# Altium project Science.PrjPCB
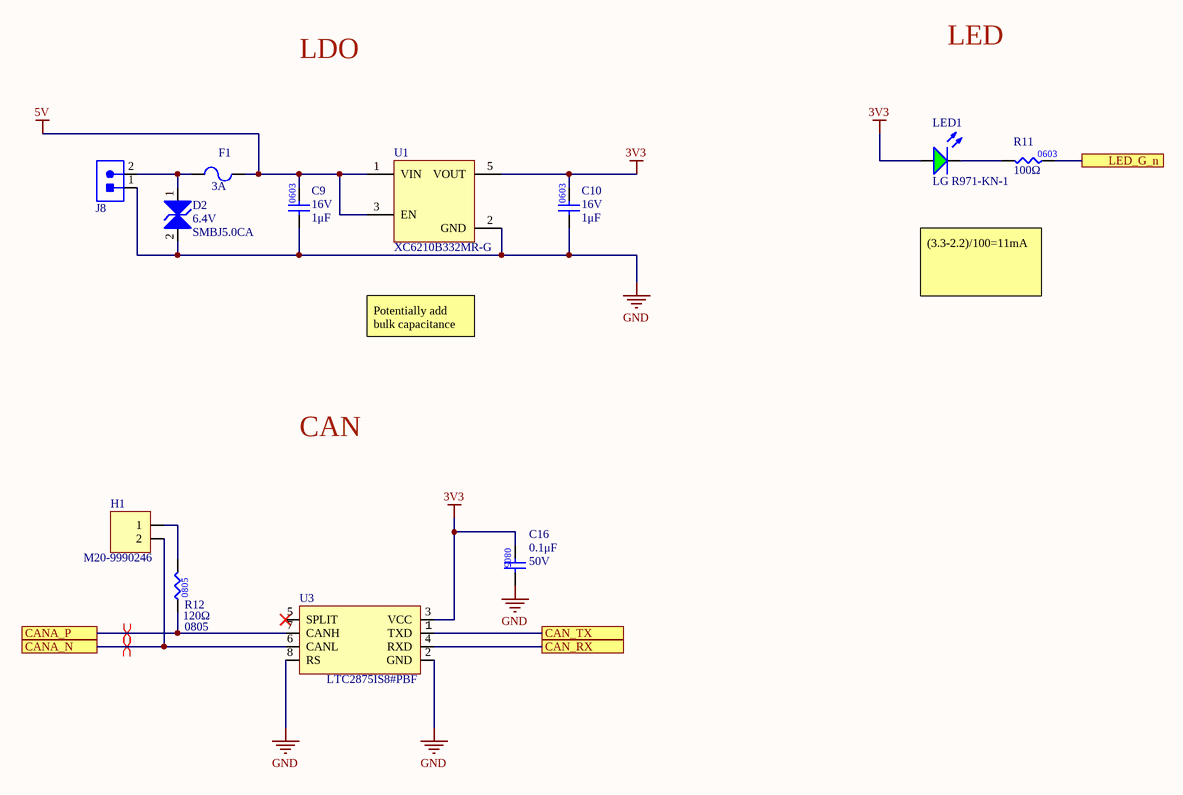
[diagram p0: SH1 - POWER, CAN, LED.SchDoc]
Address1: 200 University Avenue; Address2: Waterloo; Address3: Ontario; Address4: Canada N2L 3G6; BoardName: Your Board Name; DrawnBy: Your Name
5 sheets, 94 parts. Net scope: flat (ports and power ports of the same name join across sheets).
Board file: Science.PcbDoc
Sheets:
  SH1 - POWER, CAN, LED.SchDoc
  SH2 - CONNECTORS.SchDoc
  SH3 - MCU.SchDoc
  SH4 - Level Shifter.SchDoc
  SH5 - GPIO Expander.SchDoc

## Sheet SH1 - POWER, CAN, LED.SchDoc
size B

### Parts
C9  value 1μF  Voltage Rating: 16V  [CAP0603]  (hidden comment: CAP_1uF_16V_0603)
C10  value 1μF  Voltage Rating: 16V  [CAP0603]  (hidden comment: CAP_1uF_16V_0603)
C16  value 0.1μF  Voltage Rating: 50V  [CAP0805]  (hidden comment: CAP_0.1uF_50V_0805)
D2  Voltage - Breakdown (Min): 6.4V  Manufacturer Part Number 1: SMBJ5.0CA  [TVS_DIODE_BIDIR_SMB]  (hidden comment: TVS_DIODE_BIDIR_5V)
F1  FUSE_3A_0603  [FUSE_0603]  (value not drawn)
H1  Manufacturer Part Number 1: M20-9990246  [HDR1X2]  (hidden comment: JUMPER)
J8  CON_2POS_SCREW_TERM  [1935161]  (value not drawn)
LED1  Manufacturer Part Number 1: LG R971-KN-1  [LED_0805_GREEN]  (hidden comment: LED_GREEN)
R11  value 100Ω  [RES0603]  (hidden comment: RES_100Ω_0603_1%)
R12  value 120Ω  Package/Footprint: 0805  [RES0805]  (hidden comment: RES_120Ω_0805_1%)
U1  Manufacturer Part Number 1: XC6210B332MR-G  [SOT95P285X140-5N]  (hidden comment: LDO_3.3V_700mA)
U3  Manufacturer Part Number 1: LTC2875IS8#PBF  [LT-S8_N]  (hidden comment: IC_CAN_TRANSCEIVER)

### Ports
CAN_RX, CAN_TX, CANA_N, CANA_P, LED_G_n

### Nets
3V3: C10.2 C16.1 LED1.1(A) U1.5(VOUT) U3.3(VCC)
5V: C9.2 F1.2 U1.1(VIN) U1.3(EN)
GND: C9.1 C10.1 C16.2 D2.2 J8.1 U1.2(GND) U3.2(GND) U3.8(RS)
CAN_RX: U3.4(RXD) ; port CAN_RX
CAN_TX: U3.1(TXD) ; port CAN_TX
CANA_N: H1.2 U3.6(CANL) ; port CANA_N
CANA_P: R12.1 U3.7(CANH) ; port CANA_P
LED_G_n: R11.2 ; port LED_G_n
NetD2_1: D2.1 F1.1 J8.2
NetH1_1: H1.1 R12.2
NetLED1_2: LED1.2(K) R11.1

Not connected (* = marked no-connect by the designer): U3 5(SPLIT)*

### Layout directives
differential pair: CANA_N, CANA_P

### Notes on the sheet
- LDO
- LED
- (3.3-2.2)/100=11mA
- Potentially add bulk capacitance
- CAN
- (in symbol RES_100Ω_0603_1%) 0603

### Library data of the parts
C9 C10 = CAP_1uF_16V_0603: CAP CER 1UF 16V Y5V 0603; Manufacturer 1: Yageo; Manufacturer Part Number 1: CC0603ZRY5V7BB105; Supplier Part Number 1: 311-1372-1-ND; Supplier 1: Digi-Key; Mounting Type: SMD; Package: 0603; Dielectric: Y5V
C16 = CAP_0.1uF_50V_0805: CAP CER 0.1UF 50V X7R 0805; Manufacturer Part Number 1: GCM21BR71H104KA37K; Manufacturer 1: Murata Electronics; Package/Footprint: 0805; Supplier Part Number 1: 490-8049-1-ND; Supplier 1: Digi-Key; Dielectric: X7R; Mounting Type: SMD; LCSC Part #: C49678
D2 = TVS_DIODE_BIDIR_5V: TVS DIODE 5V 9.2V SMB; Manufacturer 1: Littelfuse; Package/Footprint: SMB; Supplier Part Number 1: SMBJ5.0CALFCT-ND; Supplier 1: Digi-Key; Mounting Type: SMD; Voltage - Reverse Standoff (Typ): 5V; Voltage - Clamping (Max) @ Ipp: 9.2V; Verified: No; LCSC Part #: *
F1 = FUSE_3A_0603: FUSE SMD 3A 32V 0603; Manufacturer Part Number 1: 0467003.NR; Manufacturer 1: Littelfuse; Supplier Part Number 1: F1399CT-ND; Supplier 1: Digi-Key; Voltage Rating (DC): 32V; Current Rating: 3A
H1 = JUMPER: HEADER 2X1; Manufacturer 1: Harwin Inc.; Package/Footprint: TH; Supplier 1: Digi-Key; Supplier Part Number 1: 952-2262-ND; Mounting Type: TH
J8 = CON_2POS_SCREW_TERM: TERM BLK 2POS SIDE ENTRY 5MM; Manufacturer 1: Phoenix Contact; Package/Footprint: SMD; Supplier 1: Digi-Key; Mounting Type: TH; Supplier Part Number 1: 277-1667-ND; Manufacturer Part Number 1: 1935161
LED1 = LED_GREEN: LED GREEN DIFFUSED 0805 SMD; Manufacturer 1: OSRAM; Forward Voltage Drop: 2.2V; Package/Footprint: 0805; Supplier Part Number 1: 475-1410-1-ND; Supplier 1: Digi-Key; Mounting Type: SMD
R11 = RES_100Ω_0603_1%: RES 100 OHM 1% 1/10W 0603; Manufacturer 1: Yageo; Manufacturer Part Number 1: RC0603FR-07100RL; Supplier Part Number 1: 311-100HRCT-ND; Supplier 1: Digi-Key
R12 = RES_120Ω_0805_1%: RES 120 OHM 1% 1/8W 0805; Manufacturer 1: Vishay; Manufacturer Part Number 1: CRCW0805120RFKEA; Supplier Part Number 1: 541-120CCT-ND; Supplier 1: Digi-Key; Mounting Type: SMD; LCSC Part #: C17437
U1 = LDO_3.3V_700mA: IC REG LINEAR 3.3V 700MA SOT25; Manufacturer 1: Diodes Incorporated; Input Voltage (Max): 6V; Voltage Dropout (Max): 0.075V; Package/Footprint: SOT-25; Output Voltage (Fixed): 3.3V; Output Current: 700mA; Operating Temperature: -40°C - 85°C; Mounting Type: SMD; Supplier 1: Digi-Key; Supplier Part Number 1: 893-1075-1-ND
U3 = IC_CAN_TRANSCEIVER: IC TXRX CAN 4MBPS 8SO; Manufacturer 1: Linear Technologies; Package/Footprint: 8-SOIC; Supplier Part Number 1: LTC2875IS8#PBF-ND; Supplier 1: Digi-Key; Mounting Type: SMD; LCSC Part #: C117076

## Sheet SH2 - CONNECTORS.SchDoc
size B
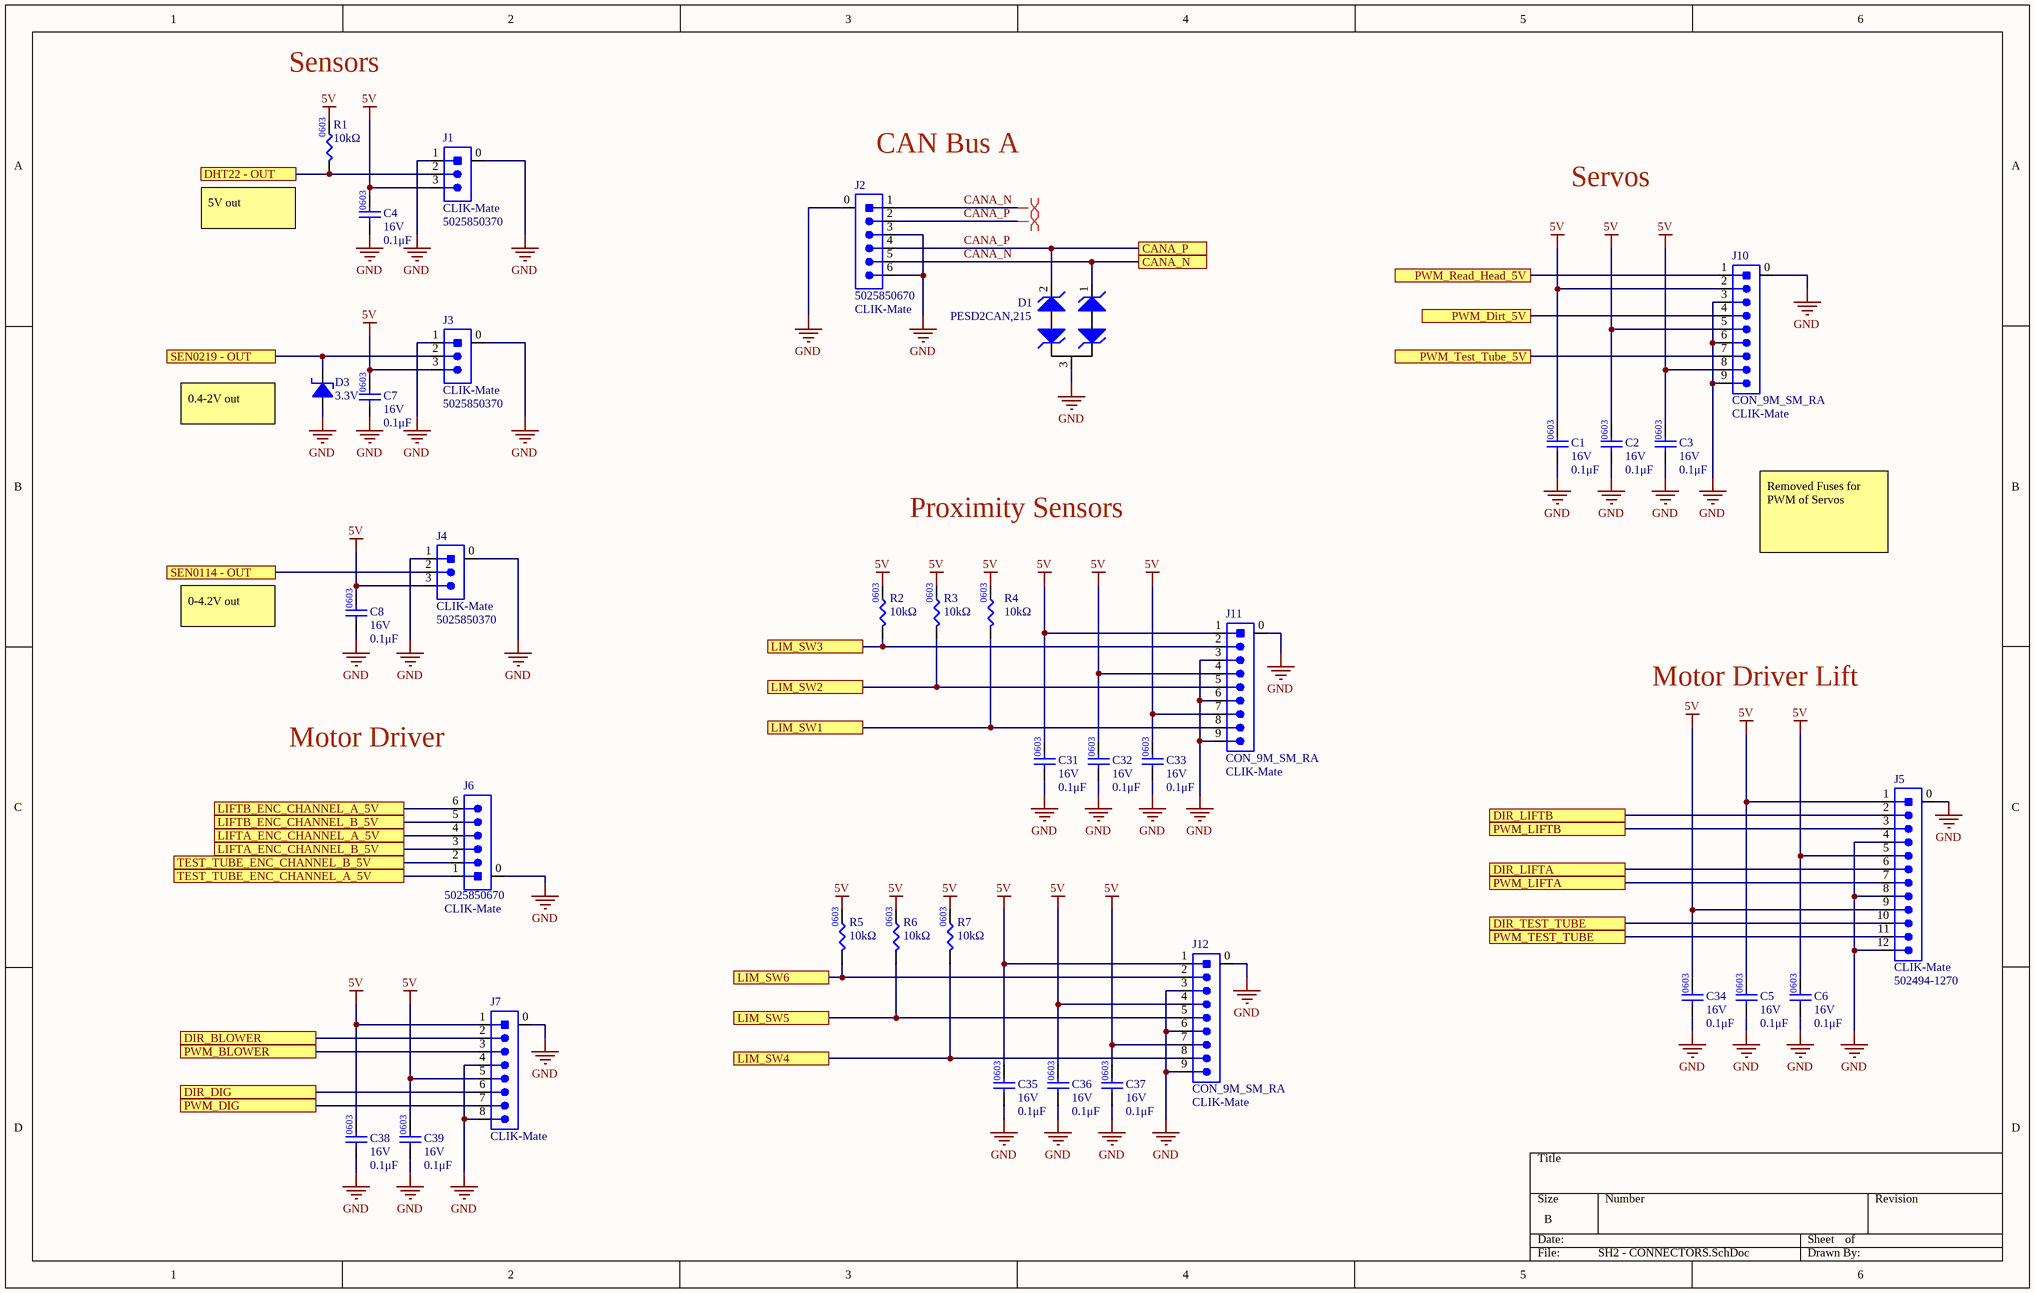
[diagram p1: SH2 - CONNECTORS.SchDoc]

### Parts
C1  value 0.1μF  Voltage Rating: 16V  [CAP0603]  (hidden comment: CAP_0.1uF_16V_0603)
C2  value 0.1μF  Voltage Rating: 16V  [CAP0603]  (hidden comment: CAP_0.1uF_16V_0603)
C3  value 0.1μF  Voltage Rating: 16V  [CAP0603]  (hidden comment: CAP_0.1uF_16V_0603)
C4  value 0.1μF  Voltage Rating: 16V  [CAP0603]  (hidden comment: CAP_0.1uF_16V_0603)
C5  value 0.1μF  Voltage Rating: 16V  [CAP0603]  (hidden comment: CAP_0.1uF_16V_0603)
C6  value 0.1μF  Voltage Rating: 16V  [CAP0603]  (hidden comment: CAP_0.1uF_16V_0603)
C7  value 0.1μF  Voltage Rating: 16V  [CAP0603]  (hidden comment: CAP_0.1uF_16V_0603)
C8  value 0.1μF  Voltage Rating: 16V  [CAP0603]  (hidden comment: CAP_0.1uF_16V_0603)
C31  value 0.1μF  Voltage Rating: 16V  [CAP0603]  (hidden comment: CAP_0.1uF_16V_0603)
C32  value 0.1μF  Voltage Rating: 16V  [CAP0603]  (hidden comment: CAP_0.1uF_16V_0603)
C33  value 0.1μF  Voltage Rating: 16V  [CAP0603]  (hidden comment: CAP_0.1uF_16V_0603)
C34  value 0.1μF  Voltage Rating: 16V  [CAP0603]  (hidden comment: CAP_0.1uF_16V_0603)
C35  value 0.1μF  Voltage Rating: 16V  [CAP0603]  (hidden comment: CAP_0.1uF_16V_0603)
C36  value 0.1μF  Voltage Rating: 16V  [CAP0603]  (hidden comment: CAP_0.1uF_16V_0603)
C37  value 0.1μF  Voltage Rating: 16V  [CAP0603]  (hidden comment: CAP_0.1uF_16V_0603)
C38  value 0.1μF  Voltage Rating: 16V  [CAP0603]  (hidden comment: CAP_0.1uF_16V_0603)
C39  value 0.1μF  Voltage Rating: 16V  [CAP0603]  (hidden comment: CAP_0.1uF_16V_0603)
D1  Manufacturer Part Number 1: PESD2CAN,215  [TVS_DIODE_CAN]  (hidden comment: TVS_DIODE_CAN)
D3  Working Voltage: 3.3V  [DIO_ZENER_3V3]  (hidden comment: DIO_ZENER_3V3)
J1  Family: CLIK-Mate  Manufacturer Part Number 1: 5025850370  [MOLEX-5025850370]  (hidden comment: CON_3M_SM_RA)
J2  Manufacturer Part Number 1: 5025850670  Family: CLIK-Mate  [MOLEX-5025850670]  (hidden comment: CON_6M_SM_RA_1.5mm)
J3  Family: CLIK-Mate  Manufacturer Part Number 1: 5025850370  [MOLEX-5025850370]  (hidden comment: CON_3M_SM_RA)
J4  Family: CLIK-Mate  Manufacturer Part Number 1: 5025850370  [MOLEX-5025850370]  (hidden comment: CON_3M_SM_RA)
J5  Family: CLIK-Mate  Supplier Part Number 1: 502494-1270  [MOLEX-5024941270]  (hidden comment: CON_12M_SM_RA_2mm)
J6  Manufacturer Part Number 1: 5025850670  Family: CLIK-Mate  [MOLEX-5025850670]  (hidden comment: CON_6M_SM_RA_1.5mm)
J7  Family: CLIK-Mate  [5024430870]  (hidden comment: CON_8M_SM_RA)
J10  CON_9M_SM_RA  Family: CLIK-Mate  [Molex-5025850970]
J11  CON_9M_SM_RA  Family: CLIK-Mate  [Molex-5025850970]
J12  CON_9M_SM_RA  Family: CLIK-Mate  [Molex-5025850970]
R1  value 10kΩ  [RES0603]  (hidden comment: RES_10kΩ_0603_5%)
R2  value 10kΩ  [RES0603]  (hidden comment: RES_10kΩ_0603_5%)
R3  value 10kΩ  [RES0603]  (hidden comment: RES_10kΩ_0603_5%)
R4  value 10kΩ  [RES0603]  (hidden comment: RES_10kΩ_0603_5%)
R5  value 10kΩ  [RES0603]  (hidden comment: RES_10kΩ_0603_5%)
R6  value 10kΩ  [RES0603]  (hidden comment: RES_10kΩ_0603_5%)
R7  value 10kΩ  [RES0603]  (hidden comment: RES_10kΩ_0603_5%)

### Ports
CANA_N, CANA_P, DHT22 - OUT, DIR_BLOWER, DIR_DIG, DIR_LIFTA, DIR_LIFTB, DIR_TEST_TUBE, LIFTA_ENC_CHANNEL_A_5V, LIFTA_ENC_CHANNEL_B_5V, LIFTB_ENC_CHANNEL_A_5V, LIFTB_ENC_CHANNEL_B_5V, LIM_SW1, LIM_SW2, LIM_SW3, LIM_SW4, LIM_SW5, LIM_SW6, PWM_BLOWER, PWM_DIG, PWM_Dirt_5V, PWM_LIFTA, PWM_LIFTB, PWM_Read_Head_5V, PWM_TEST_TUBE, PWM_Test_Tube_5V, SEN0114 - OUT, SEN0219 - OUT, TEST_TUBE_ENC_CHANNEL_A_5V, TEST_TUBE_ENC_CHANNEL_B_5V

### Nets
5V: C1.2 C2.2 C3.2 C4.2 C5.2 C6.2 C7.2 C8.2 C31.2 C32.2 C33.2 C34.2 C35.2 C36.2 C37.2 C38.2 C39.2 J1.3 J3.3 J4.3 J5.1 J5.5 J5.9 J7.1 J7.5 J10.2 J10.5 J10.8 J11.1 J11.4 J11.7 J12.1 J12.4 J12.7 R1.2 R2.2 R3.2 R4.2 R5.2 R6.2 R7.2
GND: C1.1 C2.1 C3.1 C4.1 C5.1 C6.1 C7.1 C8.1 C31.1 C32.1 C33.1 C34.1 C35.1 C36.1 C37.1 C38.1 C39.1 D1.3 D3.1(Anode) J1.0 J1.1 J2.0 J2.3 J2.6 J3.0 J3.1 J4.0 J4.1 J5.0 J5.4 J5.8 J5.12 J6.0 J7.0 J7.4 J7.8 J10.0 J10.3 J10.6 J10.9 J11.0 J11.3 J11.6 J11.9 J12.0 J12.3 J12.6 J12.9
CANA_N: D1.1 J2.1 J2.5 ; port CANA_N
CANA_P: D1.2 J2.2 J2.4 ; port CANA_P
DHT22 - OUT: J1.2 R1.1 ; port DHT22 - OUT
DIR_BLOWER: J7.2 ; port DIR_BLOWER
DIR_DIG: J7.6 ; port DIR_DIG
DIR_LIFTA: J5.6 ; port DIR_LIFTA
DIR_LIFTB: J5.2 ; port DIR_LIFTB
DIR_TEST_TUBE: J5.10 ; port DIR_TEST_TUBE
LIFTA_ENC_CHANNEL_A_5V: J6.4 ; port LIFTA_ENC_CHANNEL_A_5V
LIFTA_ENC_CHANNEL_B_5V: J6.3 ; port LIFTA_ENC_CHANNEL_B_5V
LIFTB_ENC_CHANNEL_A_5V: J6.6 ; port LIFTB_ENC_CHANNEL_A_5V
LIFTB_ENC_CHANNEL_B_5V: J6.5 ; port LIFTB_ENC_CHANNEL_B_5V
LIM_SW1: J11.8 R4.1 ; port LIM_SW1
LIM_SW2: J11.5 R3.1 ; port LIM_SW2
LIM_SW3: J11.2 R2.1 ; port LIM_SW3
LIM_SW4: J12.8 R7.1 ; port LIM_SW4
LIM_SW5: J12.5 R6.1 ; port LIM_SW5
LIM_SW6: J12.2 R5.1 ; port LIM_SW6
PWM_BLOWER: J7.3 ; port PWM_BLOWER
PWM_DIG: J7.7 ; port PWM_DIG
PWM_Dirt_5V: J10.4 ; port PWM_Dirt_5V
PWM_LIFTA: J5.7 ; port PWM_LIFTA
PWM_LIFTB: J5.3 ; port PWM_LIFTB
PWM_Read_Head_5V: J10.1 ; port PWM_Read_Head_5V
PWM_TEST_TUBE: J5.11 ; port PWM_TEST_TUBE
PWM_Test_Tube_5V: J10.7 ; port PWM_Test_Tube_5V
SEN0114 - OUT: J4.2 ; port SEN0114 - OUT
SEN0219 - OUT: D3.2(Cathode) J3.2 ; port SEN0219 - OUT
TEST_TUBE_ENC_CHANNEL_A_5V: J6.1 ; port TEST_TUBE_ENC_CHANNEL_A_5V
TEST_TUBE_ENC_CHANNEL_B_5V: J6.2 ; port TEST_TUBE_ENC_CHANNEL_B_5V

### Layout directives
differential pair: CANA_N, CANA_P

### Notes on the sheet
- Sensors
- (near J2) CAN Bus A
- (near R1) 5V out
- Servos
- (near D3) 0.4-2V out
- Proximity Sensors
- Removed Fuses for PWM of Servos
- 0-4.2V out
- Motor Driver Lift
- Motor Driver

### Library data of the parts
C1-C8 C31-C39 = CAP_0.1uF_16V_0603: CAP CER 0.1UF 16V X7R 0603; Manufacturer Part Number 1: CC0603KRX7R7BB104; Manufacturer 1: Yageo; Package: 0603; Supplier Part Number 1: 311-1088-1-ND; Supplier 1: Digi-Key; Dielectric: X7R
D1 = TVS_DIODE_CAN: TVS DIODE 24V 41V SOT323-3; Manufacturer 1: Nexperia USA Inc.; Voltage - Breakdown (Min): 26.2V; Supplier Part Number 1: 1727-3891-1-ND; Supplier 1: Digi-Key; Package/Footprint: SOT323-3; Mounting Type: SMD; Verified: Yes; Voltage - Reverse Standoff (Typ): 24V; Voltage - Clamping (Max) @ Ipp: 41V
D3 = DIO_ZENER_3V3: DIODE ZENER 3.3V 200mW SOD323F; Manufacturer 1: ON Semiconductor / Fairchild; Manufacturer Part Number 1: MM3Z3V3B; Forward Voltage: 1V; Supplier Part Number 1: MM3Z3V3BCT-ND; Supplier 1: Digi-Key; Package/Case: SOD323F
J1 J3 J4 = CON_3M_SM_RA: CONN RCPT 3POS 0.059 TIN SMD R/A; Manufacturer 1: Molex; Current Rating: 2A; Voltage Rating: 100V; Pitch: 1.5mm; Supplier 1: Digi-Key; Mounting Type: SMD; Package/Footprint: SMD; Orientation: Right Angle; Supplier Part Number 1: WM12831CT-ND
J2 J6 = CON_6M_SM_RA_1.5mm: CONN HEADER SMD RIGHT ANGLE 1.5 MM PITCH; Manufacturer 1: Molex; Supplier 1: Digi-Key; Supplier Part Number 1: WM12832CT-ND; Package/Footprint: SMD; Mounting Type: SMD
J5 = CON_12M_SM_RA_2mm: 2.00mm Pitch CLIK-Mate Wire-to-Board PCB Receptacle, Single Row, Right-Angle, 12 Circuits; Manufacturer: Molex; Number of Contacts: 12; Contact Resistance: 20mR; Current Rating: 3A; Mating Cycles: 30; Voltage Rating (AC): 250V; Insulation Resistance: 1GR; Pitch: 2mm; Glow Wire Compliant: Non-compliant; Supplier 1: Mouser; Manufacturer Part Number: 502494-1270; RoHS: Yes; Category: Headers and Wire Housings; Stock 1: 1900; Pricing 1: 950=0.62780, 1900=0.61060, 3800=0.56580, 5700=0.53600, 7600=0.52000 (USD); Mount: Surface Mount; Color: Natural,White; Contact Plating: Tin; Contact Material: Copper Alloy; Housing Material: PBT; Material: Polybutylene; Housing Color: Natural; Min Operating Temperature: -25°C; Max Operating Temperature: 85°C; Number of Rows: 1; Termination: Solder; Fastening Type: Latch; Packaging: Tape and Reel; Contact Gender: Female; Package Quantity: 950; Connector Type: Receptacle; Number of Positions: 12; Max Voltage Rating (AC): 250V; Max Voltage Rating (DC): 250V; Gender: Receptacle; Orientation: Right Angle; Number of Circuits: 12; Series: 502494; Contact Type: Center Strip Contact; Length: 28mm; Lead Pitch: 2mm; Depth: 6.85mm; Radiation Hardening: No; REACH SVHC: Unknown; Flammability Rating: UL94 V-0
J7 = CON_8M_SM: CONN HEADER SMD VERTICAL 2 MM PITCH; Current Rating: 3A; Voltage Rating: 250V; Pitch: 1.5mm; Supplier 1: Digi-Key; Mounting Type: SMD; Package/Footprint: SMD; Orientation: Right Angle; Supplier Part Number 1: WM14471CT-ND
J10-J12 = CON_9M_SM_RA: CONN RCPT 9POS CLIK-MATE 0.059 TIN SMD R/A; Current Rating: 2A; Pitch: 1.5mm; Supplier 1: Digi-Key; Orientation: Right Angle; Supplier Part Number 1: WM20816CT-ND
R1-R7 = RES_10kΩ_0603_5%: RES 10K OHM 5% 1/10W 0603; Manufacturer 1: Yageo; Manufacturer Part Number 1: RC0603JR-0710KL; Supplier Part Number 1: 311-10KGRCT-ND; Supplier 1: Digi-Key; Mounting Type: SMD; Package: 0603

## Sheet SH3 - MCU.SchDoc
size B
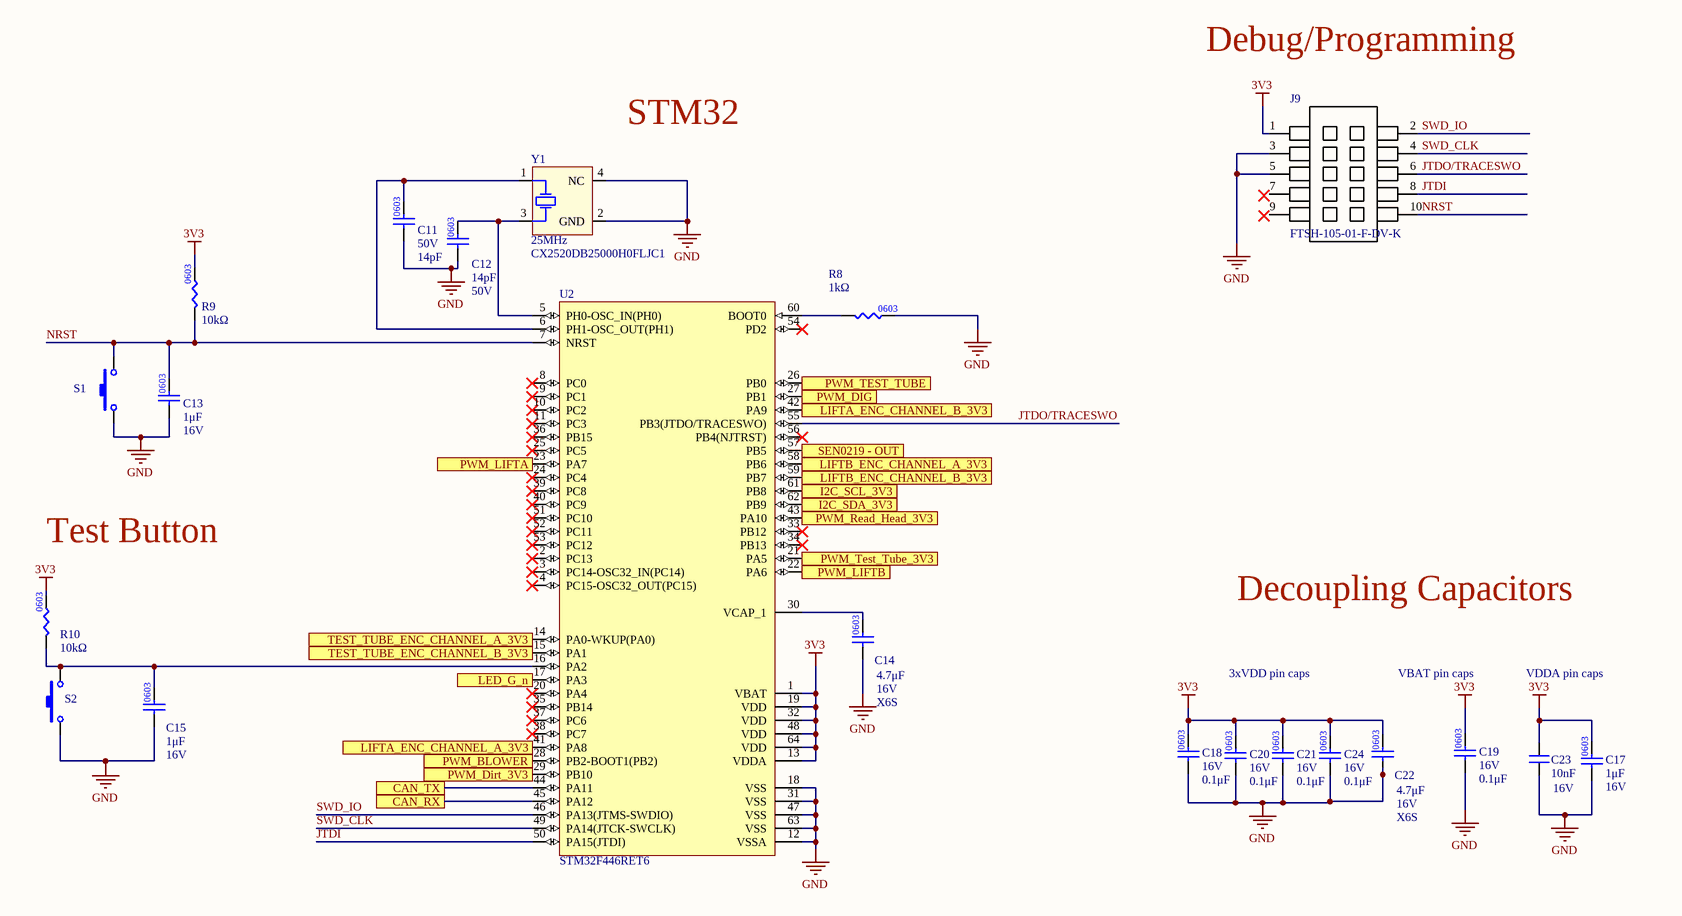
[diagram p2: SH3 - MCU.SchDoc]

### Parts
C11  value 14pF  Voltage Rating: 50V  [CAP0603]  (hidden comment: CAP_14pF_50V_0603)
C12  value 14pF  Voltage Rating: 50V  [CAP0603]  (hidden comment: CAP_14pF_50V_0603)
C13  value 1μF  Voltage Rating: 16V  [CAP0603]  (hidden comment: CAP_1uF_16V_0603)
C14  value 4.7μF  Dielectric: X6S  Voltage Rating: 16V  [CAP0603]  (hidden comment: CAP_4.7uF_16V_0603)
C15  value 1μF  Voltage Rating: 16V  [CAP0603]  (hidden comment: CAP_1uF_16V_0603)
C17  value 1μF  Voltage Rating: 16V  [CAP0603]  (hidden comment: CAP_1uF_16V_0603)
C18  value 0.1μF  Voltage Rating: 16V  [CAP0603]  (hidden comment: CAP_0.1uF_16V_0603)
C19  value 0.1μF  Voltage Rating: 16V  [CAP0603]  (hidden comment: CAP_0.1uF_16V_0603)
C20  value 0.1μF  Voltage Rating: 16V  [CAP0603]  (hidden comment: CAP_0.1uF_16V_0603)
C21  value 0.1μF  Voltage Rating: 16V  [CAP0603]  (hidden comment: CAP_0.1uF_16V_0603)
C22  value 4.7μF  Dielectric: X6S  Voltage Rating: 16V  [CAP0603]  (hidden comment: CAP_4.7uF_16V_0603)
C23  value 10nF  Voltage Rating: 16V  [CAP0603]  (hidden comment: CAP_10nF_0603)
C24  value 0.1μF  Voltage Rating: 16V  [CAP0603]  (hidden comment: CAP_0.1uF_16V_0603)
J9  Manufacturer Part Number 1: FTSH-105-01-F-DV-K  [FTSH-105-01-F-DV-K-P-TR]  (hidden comment: CON_PROGRAMMING)
R8  value 1kΩ  [RES0603]  (hidden comment: RES_1kΩ_0603_5%)
R9  value 10kΩ  [RES0603]  (hidden comment: RES_10kΩ_0603_5%)
R10  value 10kΩ  [RES0603]  (hidden comment: RES_10kΩ_0603_5%)
S1  SW_TACTILE  [B3U-1000P]  (value not drawn)
S2  SW_TACTILE  [B3U-1000P]  (value not drawn)
U2  STM32F446RET6  [STM-LQFP64_L]
Y1  Frequency: 25MHz  Manufacturer Part Number 1: CX2520DB25000H0FLJC1  [SOIC254P1016X440-4N]  (hidden comment: CRYSTAL_25MHZ)

### Ports
CAN_RX, CAN_TX, I2C_SCL_3V3, I2C_SDA_3V3, LED_G_n, LIFTA_ENC_CHANNEL_A_3V3, LIFTA_ENC_CHANNEL_B_3V3, LIFTB_ENC_CHANNEL_A_3V3, LIFTB_ENC_CHANNEL_B_3V3, PWM_BLOWER, PWM_DIG, PWM_Dirt_3V3, PWM_LIFTA, PWM_LIFTB, PWM_Read_Head_3V3, PWM_TEST_TUBE, PWM_Test_Tube_3V3, SEN0219 - OUT, TEST_TUBE_ENC_CHANNEL_A_3V3, TEST_TUBE_ENC_CHANNEL_B_3V3

### Nets
3V3: C17.2 C18.2 C19.2 C20.2 C21.2 C22.2 C23.2 C24.2 J9.1 R9.2 R10.2 U2.1(VBAT) U2.13(VDDA) U2.19(VDD) U2.32(VDD) U2.48(VDD) U2.64(VDD)
GND: C11.1 C12.1 C13.1 C14.1 C15.1 C17.1 C18.1 C19.1 C20.1 C21.1 C22.1 C23.1 C24.1 J9.3 J9.5 R8.2 S1.2 S2.1 U2.12(VSSA) U2.18(VSS) U2.31(VSS) U2.47(VSS) U2.63(VSS) Y1.2(GND) Y1.4(NC)
CAN_RX: U2.45(PA12) ; port CAN_RX
CAN_TX: U2.44(PA11) ; port CAN_TX
I2C_SCL_3V3: U2.61(PB8) ; port I2C_SCL_3V3
I2C_SDA_3V3: U2.62(PB9) ; port I2C_SDA_3V3
JTDI: J9.8 U2.50(PA15(JTDI))
JTDO/TRACESWO: J9.6 U2.55(PB3(JTDO/TRACESWO))
LED_G_n: U2.17(PA3) ; port LED_G_n
LIFTA_ENC_CHANNEL_A_3V3: U2.41(PA8) ; port LIFTA_ENC_CHANNEL_A_3V3
LIFTA_ENC_CHANNEL_B_3V3: U2.42(PA9) ; port LIFTA_ENC_CHANNEL_B_3V3
LIFTB_ENC_CHANNEL_A_3V3: U2.58(PB6) ; port LIFTB_ENC_CHANNEL_A_3V3
LIFTB_ENC_CHANNEL_B_3V3: U2.59(PB7) ; port LIFTB_ENC_CHANNEL_B_3V3
NRST: C13.2 J9.10 R9.1 S1.1 U2.7(NRST)
PWM_BLOWER: U2.28(PB2-BOOT1(PB2)) ; port PWM_BLOWER
PWM_DIG: U2.27(PB1) ; port PWM_DIG
PWM_Dirt_3V3: U2.29(PB10) ; port PWM_Dirt_3V3
PWM_LIFTA: U2.23(PA7) ; port PWM_LIFTA
PWM_LIFTB: U2.22(PA6) ; port PWM_LIFTB
PWM_Read_Head_3V3: U2.43(PA10) ; port PWM_Read_Head_3V3
PWM_TEST_TUBE: U2.26(PB0) ; port PWM_TEST_TUBE
PWM_Test_Tube_3V3: U2.21(PA5) ; port PWM_Test_Tube_3V3
SEN0219 - OUT: U2.57(PB5) ; port SEN0219 - OUT
SWD_CLK: J9.4 U2.49(PA14(JTCK-SWCLK))
SWD_IO: J9.2 U2.46(PA13(JTMS-SWDIO))
TEST_TUBE_ENC_CHANNEL_A_3V3: U2.14(PA0-WKUP(PA0)) ; port TEST_TUBE_ENC_CHANNEL_A_3V3
TEST_TUBE_ENC_CHANNEL_B_3V3: U2.15(PA1) ; port TEST_TUBE_ENC_CHANNEL_B_3V3
NetC11_2: C11.2 U2.6(PH1-OSC_OUT(PH1)) Y1.1(HOT)
NetC12_2: C12.2 U2.5(PH0-OSC_IN(PH0)) Y1.3(HOT)
NetC14_2: C14.2 U2.30(VCAP_1)
NetC15_2: C15.2 R10.1 S2.2 U2.16(PA2)
NetR8_1: R8.1 U2.60(BOOT0)

Not connected (* = marked no-connect by the designer): J9 7 9; U2 2(PC13)* 3(PC14-OSC32_IN(PC14))* 4(PC15-OSC32_OUT(PC15))* 8(PC0)* 9(PC1)* 10(PC2)* 11(PC3)* 20(PA4)* 24(PC4)* 25(PC5)* 33(PB12)* 34(PB13)* 35(PB14)* 36(PB15)* 37(PC6)* 38(PC7)* 39(PC8)* 40(PC9)* 51(PC10)* 52(PC11)* 53(PC12)* 54(PD2)* 56(PB4(NJTRST))*

### Notes on the sheet
- Debug/Programming
- STM32
- Test Button
- Decoupling Capacitors
- 3xVDD pin caps
- VBAT pin caps
- VDDA pin caps

### Library data of the parts
C11 C12 = CAP_14pF_50V_0603: CAP CER 14PF 50V C0G/NP0 0603; Manufacturer 1: Samsung; Manufacturer Part Number 1: CL10C140JB8NNNC; Dielectric: C0G; Supplier 1: Digi-Key; Supplier Part Number 1: 1276-2187-1-ND; Mounting Type: SMD; Package: 0603
C13 C15 C17 = CAP_1uF_16V_0603: as C9 on sheet SH1 - POWER, CAN, LED; Dielectric: Y5V; Supplier 1: Digi-Key; Supplier Part Number 1: 311-1372-1-ND; Package: 0603; Mounting Type: SMD
C14 C22 = CAP_4.7uF_16V_0603: CAP CER 4.7UF 16V X6S 0603; Manufacturer Part Number 1: GRM188C81C475KE11D; Manufacturer 1: Murata Electronics; Package: 0603; Supplier Part Number 1: 490-13362-1-ND; Supplier 1: Digi-Key; Mounting Type: SMD
C18-C21 C24 = CAP_0.1uF_16V_0603: as C1 on sheet SH2 - CONNECTORS; Package: 0603; Supplier Part Number 1: 311-1088-1-ND; Supplier 1: Digi-Key; Dielectric: X7R
C23 = CAP_10nF_0603: CAP CER 10000PF 16V X7R 0603; Manufacturer Part Number 1: CC0603KRX7R7BB103; Manufacturer 1: Yageo; Package/Footprint: 0603; Supplier Part Number 1: 311-3369-1-ND; Supplier 1: Digi-Key; Dielectric: X7R; Mounting Type: SMD
J9 = CON_PROGRAMMING: CONN HEADER SMD 10POS 1.27MM; Manufacturer 1: Samtec; Supplier 1: Digi-Key; Pitch: 1.27mm; Supplier Part Number 1: SAM8796-ND; Mounting Type: SMD
R8 = RES_1kΩ_0603_5%: RES 1K OHM 5% 1/10W 0603; Manufacturer 1: Yageo; Manufacturer Part Number 1: RC0603JR-071KL; Supplier Part Number 1: 311-1.0KGRCT-ND; Supplier 1: Digi-Key; Mounting Type: SMD; Package: 0603
R9 R10 = RES_10kΩ_0603_5%: as R1 on sheet SH2 - CONNECTORS; Supplier 1: Digi-Key; Supplier Part Number 1: 311-10KGRCT-ND; Package: 0603; Mounting Type: SMD
S1 S2 = SW_TACTILE: SWITCH TACTILE SPST-NO 0.05A 12V; Manufacturer 1: Omron Electronics Inc-EMC Div; Package/Footprint: SMD; Manufacturer Part Number 1: B3U-1000P; Supplier 1: Digi-Key; Supplier Part Number 1: SW1020CT-ND; Mounting Type: SMD
U2 = MCU_STM32F446RET6: ARM Cortex-M4 32-bit MCU+FPU, 512 KB Flash, 128 KB Internal RAM, 50 I/Os, 64-Pin LQFP, -40 to 85 degC, Tray; I/Os (High Current): 50; Supply Voltage(Vcc) min (V): 1.7; Operating Frequency(F) (Processor speed) (MHz): 180; D/A Converter: 2; Internal RAM Size (kB): 128; FLASH Size (Prog) (kB): 512; Core: ARM Cortex-M4; ComponentLink1Description: Manufacturer URL; Package Reference: 64-Pin Low-profile Quad Flat Package, Body 10 x 10 mm, Pitch 0.5 mm; ComponentLink2URL: http://www.st.com/st-web-ui/static/active/en/resource/technical/document/datasheet/DM00141306.pdf; Packing: Tray; DatasheetVersion: Rev. 6; ComponentLink1URL: http://www.st.com/; ComponentLink2Description: Datasheet; Package Description: LQFP64; Mounting Technology: Surface Mount; Supplier 1: Digi-Key; Supplier Part Number 1: 497-15376-ND
Y1 = CRYSTAL_25MHZ: CRYSTAL 25.0000MHZ 12PF SMD; Manufacturer 1: Kyocera AVX; Load Capacitance: 12pF; Supplier 1: Digi-Key; Supplier Part Number 1: 1253-1724-1-ND; Mounting Type: SMD; Package/Footprint: SMD

## Sheet SH4 - Level Shifter.SchDoc
size A4
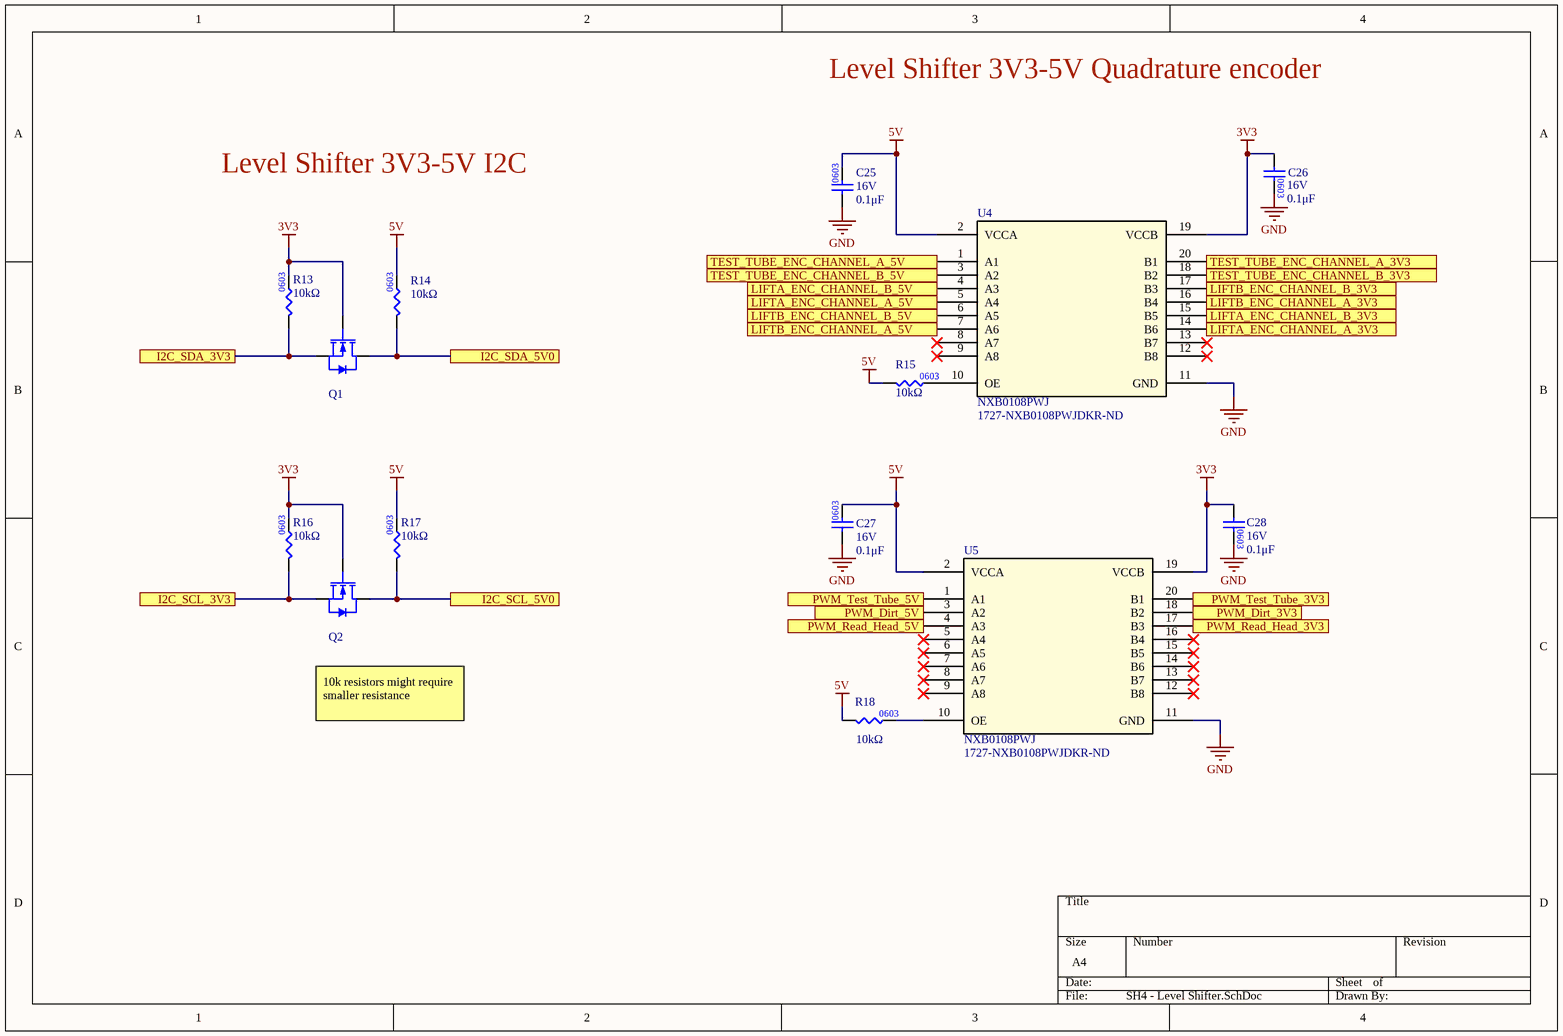
[diagram p3: SH4 - Level Shifter.SchDoc]

### Parts
C25  value 0.1μF  Voltage Rating: 16V  [CAP0603]  (hidden comment: CAP_0.1uF_16V_0603)
C26  value 0.1μF  Voltage Rating: 16V  [CAP0603]  (hidden comment: CAP_0.1uF_16V_0603)
C27  value 0.1μF  Voltage Rating: 16V  [CAP0603]  (hidden comment: CAP_0.1uF_16V_0603)
C28  value 0.1μF  Voltage Rating: 16V  [CAP0603]  (hidden comment: CAP_0.1uF_16V_0603)
Q1  NMOS_60V_280mA  [SOT-323]  (value not drawn)
Q2  NMOS_60V_280mA  [SOT-323]  (value not drawn)
R13  value 10kΩ  [RES0603]  (hidden comment: RES_10kΩ_0603_5%)
R14  value 10kΩ  [RES0603]  (hidden comment: RES_10kΩ_0603_5%)
R15  value 10kΩ  [RES0603]  (hidden comment: RES_10kΩ_0603_5%)
R16  value 10kΩ  [RES0603]  (hidden comment: RES_10kΩ_0603_5%)
R17  value 10kΩ  [RES0603]  (hidden comment: RES_10kΩ_0603_5%)
R18  value 10kΩ  [RES0603]  (hidden comment: RES_10kΩ_0603_5%)
U4  Manufacturer Part Number 1: NXB0108PWJ  Supplier Part Number 1: 1727-NXB0108PWJDKR-ND  [LEVEL_SHIFTER_8_CHANNEL]  (hidden comment: IC_LVL_SHIFTER_8_CH)
U5  Manufacturer Part Number 1: NXB0108PWJ  Supplier Part Number 1: 1727-NXB0108PWJDKR-ND  [LEVEL_SHIFTER_8_CHANNEL]  (hidden comment: IC_LVL_SHIFTER_8_CH)

### Ports
I2C_SCL_3V3, I2C_SCL_5V0, I2C_SDA_3V3, I2C_SDA_5V0, LIFTA_ENC_CHANNEL_A_3V3, LIFTA_ENC_CHANNEL_A_5V, LIFTA_ENC_CHANNEL_B_3V3, LIFTA_ENC_CHANNEL_B_5V, LIFTB_ENC_CHANNEL_A_3V3, LIFTB_ENC_CHANNEL_A_5V, LIFTB_ENC_CHANNEL_B_3V3, LIFTB_ENC_CHANNEL_B_5V, PWM_Dirt_3V3, PWM_Dirt_5V, PWM_Read_Head_3V3, PWM_Read_Head_5V, PWM_Test_Tube_3V3, PWM_Test_Tube_5V, TEST_TUBE_ENC_CHANNEL_A_3V3, TEST_TUBE_ENC_CHANNEL_A_5V, TEST_TUBE_ENC_CHANNEL_B_3V3, TEST_TUBE_ENC_CHANNEL_B_5V

### Nets
3V3: C26.1 C28.1 Q1.1(Gate) Q2.1(Gate) R13.2 R16.2 U4.19(VCCB) U5.19(VCCB)
5V: C25.2 C27.2 R14.2 R15.1 R17.2 R18.1 U4.2(VCCA) U5.2(VCCA)
GND: C25.1 C26.2 C27.1 C28.2 U4.11(GND) U5.11(GND)
I2C_SCL_3V3: Q2.2(Source) R16.1 ; port I2C_SCL_3V3
I2C_SCL_5V0: Q2.3(Drain) R17.1 ; port I2C_SCL_5V0
I2C_SDA_3V3: Q1.2(Source) R13.1 ; port I2C_SDA_3V3
I2C_SDA_5V0: Q1.3(Drain) R14.1 ; port I2C_SDA_5V0
LIFTA_ENC_CHANNEL_A_3V3: U4.14(B6) ; port LIFTA_ENC_CHANNEL_A_3V3
LIFTA_ENC_CHANNEL_A_5V: U4.5(A4) ; port LIFTA_ENC_CHANNEL_A_5V
LIFTA_ENC_CHANNEL_B_3V3: U4.15(B5) ; port LIFTA_ENC_CHANNEL_B_3V3
LIFTA_ENC_CHANNEL_B_5V: U4.4(A3) ; port LIFTA_ENC_CHANNEL_B_5V
LIFTB_ENC_CHANNEL_A_3V3: U4.16(B4) ; port LIFTB_ENC_CHANNEL_A_3V3
LIFTB_ENC_CHANNEL_A_5V: U4.7(A6) ; port LIFTB_ENC_CHANNEL_A_5V
LIFTB_ENC_CHANNEL_B_3V3: U4.17(B3) ; port LIFTB_ENC_CHANNEL_B_3V3
LIFTB_ENC_CHANNEL_B_5V: U4.6(A5) ; port LIFTB_ENC_CHANNEL_B_5V
PWM_Dirt_3V3: U5.18(B2) ; port PWM_Dirt_3V3
PWM_Dirt_5V: U5.3(A2) ; port PWM_Dirt_5V
PWM_Read_Head_3V3: U5.17(B3) ; port PWM_Read_Head_3V3
PWM_Read_Head_5V: U5.4(A3) ; port PWM_Read_Head_5V
PWM_Test_Tube_3V3: U5.20(B1) ; port PWM_Test_Tube_3V3
PWM_Test_Tube_5V: U5.1(A1) ; port PWM_Test_Tube_5V
TEST_TUBE_ENC_CHANNEL_A_3V3: U4.20(B1) ; port TEST_TUBE_ENC_CHANNEL_A_3V3
TEST_TUBE_ENC_CHANNEL_A_5V: U4.1(A1) ; port TEST_TUBE_ENC_CHANNEL_A_5V
TEST_TUBE_ENC_CHANNEL_B_3V3: U4.18(B2) ; port TEST_TUBE_ENC_CHANNEL_B_3V3
TEST_TUBE_ENC_CHANNEL_B_5V: U4.3(A2) ; port TEST_TUBE_ENC_CHANNEL_B_5V
NetR15_2: R15.2 U4.10(OE)
NetR18_2: R18.2 U5.10(OE)

Not connected (* = marked no-connect by the designer): U4 8(A7)* 9(A8)* 12(B8)* 13(B7)*; U5 5(A4)* 6(A5)* 7(A6)* 8(A7)* 9(A8)* 12(B8)* 13(B7)* 14(B6)* 15(B5)* 16(B4)*

### Notes on the sheet
- Level Shifter 3V3-5V Quadrature encoder
- Level Shifter 3V3-5V I2C
- 10k resistors might require smaller resistance

### Library data of the parts
C25-C28 = CAP_0.1uF_16V_0603: as C1 on sheet SH2 - CONNECTORS; Package: 0603; Supplier Part Number 1: 311-1088-1-ND; Supplier 1: Digi-Key; Dielectric: X7R
Q1 Q2 = NMOS_60V_280mA: MOSFET N-CH 60V 280MA SOT323-3; Manufacturer 1: Infineon Technologies; Manufacturer Part Number 1: BSS138WH6327XTSA1; FET Type: N-Channel; Vgs (Max): 20V; Power Dissipation (Max): 500mW; Vdss: 60V; Supplier Device Package: SOT-323; Id: 280mA; Supplier 1: Digi-Key; Supplier Part Number 1: BSS138WH6327XTSA1CT-ND
R13-R18 = RES_10kΩ_0603_5%: as R1 on sheet SH2 - CONNECTORS; Supplier Part Number 1: 311-10KGRCT-ND; Supplier 1: Digi-Key; Mounting Type: SMD; Package: 0603
U4 U5 = IC_LVL_SHIFTER_8_CH_NEXPERIA: IC BIDIRECTIONAL LEVEL SHIFTER 8 CHANNEL 20TSSOP NEXPERIA; Manufacturer 1: Nexperia USA Inc.; Package/Footprint: 20-TSSOP; Mounting Type: SMD; Supplier 1: Digi-Key

## Sheet SH5 - GPIO Expander.SchDoc
size A4
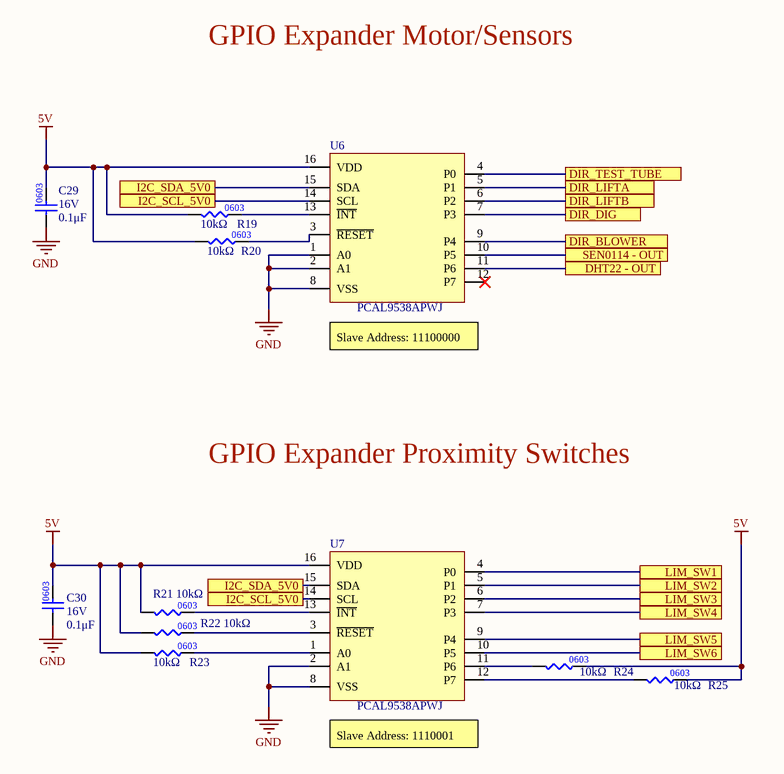
[diagram p4: SH5 - GPIO Expander.SchDoc]

### Parts
C29  value 0.1μF  Voltage Rating: 16V  [CAP0603]  (hidden comment: CAP_0.1uF_16V_0603)
C30  value 0.1μF  Voltage Rating: 16V  [CAP0603]  (hidden comment: CAP_0.1uF_16V_0603)
R19  value 10kΩ  [RES0603]  (hidden comment: RES_10kΩ_0603_5%)
R20  value 10kΩ  [RES0603]  (hidden comment: RES_10kΩ_0603_5%)
R21  value 10kΩ  [RES0603]  (hidden comment: RES_10kΩ_0603_5%)
R22  value 10kΩ  [RES0603]  (hidden comment: RES_10kΩ_0603_5%)
R23  value 10kΩ  [RES0603]  (hidden comment: RES_10kΩ_0603_5%)
R24  value 10kΩ  [RES0603]  (hidden comment: RES_10kΩ_0603_5%)
R25  value 10kΩ  [RES0603]  (hidden comment: RES_10kΩ_0603_5%)
U6  8 Channel I2C GPIO Expander  [TSSOP16]  (value not drawn)
U7  8 Channel I2C GPIO Expander  [TSSOP16]  (value not drawn)

### Ports
DHT22 - OUT, DIR_BLOWER, DIR_DIG, DIR_LIFTA, DIR_LIFTB, DIR_TEST_TUBE, I2C_SCL_5V0, I2C_SDA_5V0, LIM_SW1, LIM_SW2, LIM_SW3, LIM_SW4, LIM_SW5, LIM_SW6, SEN0114 - OUT

### Nets
5V: C29.2 C30.2 R19.1 R20.1 R21.1 R22.1 R23.1 R24.2 R25.2 U6.16(VDD) U7.16(VDD)
GND: C29.1 C30.1 U6.1(A0) U6.2(A1) U6.8(VSS) U7.2(A1) U7.8(VSS)
DHT22 - OUT: U6.11(P6) ; port DHT22 - OUT
DIR_BLOWER: U6.9(P4) ; port DIR_BLOWER
DIR_DIG: U6.7(P3) ; port DIR_DIG
DIR_LIFTA: U6.5(P1) ; port DIR_LIFTA
DIR_LIFTB: U6.6(P2) ; port DIR_LIFTB
DIR_TEST_TUBE: U6.4(P0) ; port DIR_TEST_TUBE
I2C_SCL_5V0: U6.14(SCL) U7.14(SCL) ; port I2C_SCL_5V0
I2C_SDA_5V0: U6.15(SDA) U7.15(SDA) ; port I2C_SDA_5V0
LIM_SW1: U7.4(P0) ; port LIM_SW1
LIM_SW2: U7.5(P1) ; port LIM_SW2
LIM_SW3: U7.6(P2) ; port LIM_SW3
LIM_SW4: U7.7(P3) ; port LIM_SW4
LIM_SW5: U7.9(P4) ; port LIM_SW5
LIM_SW6: U7.10(P5) ; port LIM_SW6
SEN0114 - OUT: U6.10(P5) ; port SEN0114 - OUT
NetR19_2: R19.2 U6.13(~{INT})
NetR20_2: R20.2 U6.3(~{RESET})
NetR21_2: R21.2 U7.13(~{INT})
NetR22_2: R22.2 U7.3(~{RESET})
NetR23_2: R23.2 U7.1(A0)
NetR24_1: R24.1 U7.11(P6)
NetR25_1: R25.1 U7.12(P7)

Not connected (* = marked no-connect by the designer): U6 12(P7)*

### Notes on the sheet
- GPIO Expander Motor/Sensors
- (near U6) Slave Address: 11100000
- GPIO Expander Proximity Switches
- (near U7) Slave Address: 1110001
- (in symbol IC_GPIO_I2C_EXPANDER 8CH 16TSSOP) PCAL9538APWJ

### Library data of the parts
C29 C30 = CAP_0.1uF_16V_0603: as C1 on sheet SH2 - CONNECTORS; Package: 0603; Supplier Part Number 1: 311-1088-1-ND; Supplier 1: Digi-Key; Dielectric: X7R
R19-R25 = RES_10kΩ_0603_5%: as R1 on sheet SH2 - CONNECTORS; Supplier Part Number 1: 311-10KGRCT-ND; Supplier 1: Digi-Key; Mounting Type: SMD; Package: 0603
U6 U7 = IC_GPIO_I2C_EXPANDER 8CH 16TSSOP: Manufacturer: NXP USA Inc.; Voltage - Supply: 1.65V ~ 5.5V; Clock Frequency: 400 kHz; Current - Output Source/Sink: 10mA, 25mA; Supplier 1: Digi-Key; Package / Case: 16-TSSOP; Operating Temperature: -40°C ~ 85°C; Supplier Part Number 1: 568-9924-1-ND

## Nets that join several sheets
3V3: SH1 - POWER, CAN, LED (5 pins), SH3 - MCU (17 pins), SH4 - Level Shifter (8 pins)
5V: SH1 - POWER, CAN, LED (C9.2 F1.2 U1.1 U1.3), SH2 - CONNECTORS (41 pins), SH4 - Level Shifter (8 pins), SH5 - GPIO Expander (11 pins)
GND: SH1 - POWER, CAN, LED (8 pins), SH2 - CONNECTORS (48 pins), SH3 - MCU (25 pins), SH4 - Level Shifter (6 pins), SH5 - GPIO Expander (7 pins)
CAN_RX: SH1 - POWER, CAN, LED (U3.4), SH3 - MCU (U2.45)
CAN_TX: SH1 - POWER, CAN, LED (U3.1), SH3 - MCU (U2.44)
CANA_N: SH1 - POWER, CAN, LED (H1.2 U3.6), SH2 - CONNECTORS (D1.1 J2.1 J2.5)
CANA_P: SH1 - POWER, CAN, LED (R12.1 U3.7), SH2 - CONNECTORS (D1.2 J2.2 J2.4)
DHT22 - OUT: SH2 - CONNECTORS (J1.2 R1.1), SH5 - GPIO Expander (U6.11)
DIR_BLOWER: SH2 - CONNECTORS (J7.2), SH5 - GPIO Expander (U6.9)
DIR_DIG: SH2 - CONNECTORS (J7.6), SH5 - GPIO Expander (U6.7)
DIR_LIFTA: SH2 - CONNECTORS (J5.6), SH5 - GPIO Expander (U6.5)
DIR_LIFTB: SH2 - CONNECTORS (J5.2), SH5 - GPIO Expander (U6.6)
DIR_TEST_TUBE: SH2 - CONNECTORS (J5.10), SH5 - GPIO Expander (U6.4)
I2C_SCL_3V3: SH3 - MCU (U2.61), SH4 - Level Shifter (Q2.2 R16.1)
I2C_SCL_5V0: SH4 - Level Shifter (Q2.3 R17.1), SH5 - GPIO Expander (U6.14 U7.14)
I2C_SDA_3V3: SH3 - MCU (U2.62), SH4 - Level Shifter (Q1.2 R13.1)
I2C_SDA_5V0: SH4 - Level Shifter (Q1.3 R14.1), SH5 - GPIO Expander (U6.15 U7.15)
LED_G_n: SH1 - POWER, CAN, LED (R11.2), SH3 - MCU (U2.17)
LIFTA_ENC_CHANNEL_A_3V3: SH3 - MCU (U2.41), SH4 - Level Shifter (U4.14)
LIFTA_ENC_CHANNEL_A_5V: SH2 - CONNECTORS (J6.4), SH4 - Level Shifter (U4.5)
LIFTA_ENC_CHANNEL_B_3V3: SH3 - MCU (U2.42), SH4 - Level Shifter (U4.15)
LIFTA_ENC_CHANNEL_B_5V: SH2 - CONNECTORS (J6.3), SH4 - Level Shifter (U4.4)
LIFTB_ENC_CHANNEL_A_3V3: SH3 - MCU (U2.58), SH4 - Level Shifter (U4.16)
LIFTB_ENC_CHANNEL_A_5V: SH2 - CONNECTORS (J6.6), SH4 - Level Shifter (U4.7)
LIFTB_ENC_CHANNEL_B_3V3: SH3 - MCU (U2.59), SH4 - Level Shifter (U4.17)
LIFTB_ENC_CHANNEL_B_5V: SH2 - CONNECTORS (J6.5), SH4 - Level Shifter (U4.6)
LIM_SW1: SH2 - CONNECTORS (J11.8 R4.1), SH5 - GPIO Expander (U7.4)
LIM_SW2: SH2 - CONNECTORS (J11.5 R3.1), SH5 - GPIO Expander (U7.5)
LIM_SW3: SH2 - CONNECTORS (J11.2 R2.1), SH5 - GPIO Expander (U7.6)
LIM_SW4: SH2 - CONNECTORS (J12.8 R7.1), SH5 - GPIO Expander (U7.7)
LIM_SW5: SH2 - CONNECTORS (J12.5 R6.1), SH5 - GPIO Expander (U7.9)
LIM_SW6: SH2 - CONNECTORS (J12.2 R5.1), SH5 - GPIO Expander (U7.10)
PWM_BLOWER: SH2 - CONNECTORS (J7.3), SH3 - MCU (U2.28)
PWM_DIG: SH2 - CONNECTORS (J7.7), SH3 - MCU (U2.27)
PWM_Dirt_3V3: SH3 - MCU (U2.29), SH4 - Level Shifter (U5.18)
PWM_Dirt_5V: SH2 - CONNECTORS (J10.4), SH4 - Level Shifter (U5.3)
PWM_LIFTA: SH2 - CONNECTORS (J5.7), SH3 - MCU (U2.23)
PWM_LIFTB: SH2 - CONNECTORS (J5.3), SH3 - MCU (U2.22)
PWM_Read_Head_3V3: SH3 - MCU (U2.43), SH4 - Level Shifter (U5.17)
PWM_Read_Head_5V: SH2 - CONNECTORS (J10.1), SH4 - Level Shifter (U5.4)
PWM_TEST_TUBE: SH2 - CONNECTORS (J5.11), SH3 - MCU (U2.26)
PWM_Test_Tube_3V3: SH3 - MCU (U2.21), SH4 - Level Shifter (U5.20)
PWM_Test_Tube_5V: SH2 - CONNECTORS (J10.7), SH4 - Level Shifter (U5.1)
SEN0114 - OUT: SH2 - CONNECTORS (J4.2), SH5 - GPIO Expander (U6.10)
SEN0219 - OUT: SH2 - CONNECTORS (D3.2 J3.2), SH3 - MCU (U2.57)
TEST_TUBE_ENC_CHANNEL_A_3V3: SH3 - MCU (U2.14), SH4 - Level Shifter (U4.20)
TEST_TUBE_ENC_CHANNEL_A_5V: SH2 - CONNECTORS (J6.1), SH4 - Level Shifter (U4.1)
TEST_TUBE_ENC_CHANNEL_B_3V3: SH3 - MCU (U2.15), SH4 - Level Shifter (U4.18)
TEST_TUBE_ENC_CHANNEL_B_5V: SH2 - CONNECTORS (J6.2), SH4 - Level Shifter (U4.3)